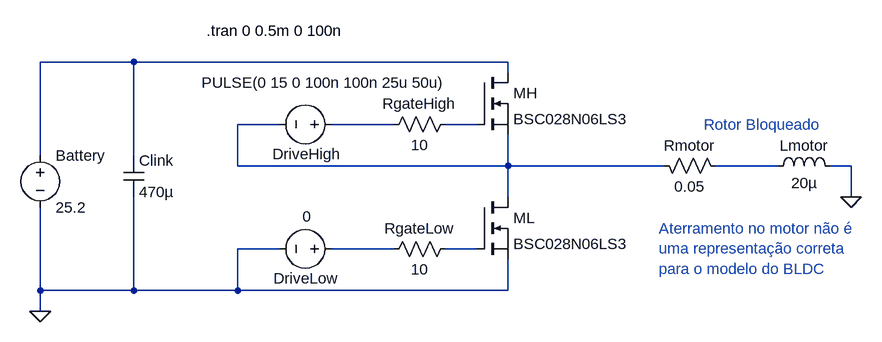
[diagram p0: schematic monofasico.asc]
monofasico.asc, the LTspice schematic file:
Version 4.1
SHEET 1 1412 992
WIRE -1024 -160 -1168 -160
WIRE -448 -160 -1024 -160
WIRE -448 -144 -448 -160
WIRE -800 -64 -864 -64
WIRE -624 -64 -720 -64
WIRE -496 -64 -544 -64
WIRE -1168 -16 -1168 -160
WIRE -1024 -16 -1024 -160
WIRE -864 0 -864 -64
WIRE -448 0 -448 -48
WIRE -448 0 -864 0
WIRE -208 0 -448 0
WIRE -32 0 -128 0
WIRE 80 0 48 0
WIRE -448 48 -448 0
WIRE 80 48 80 0
WIRE -800 128 -864 128
WIRE -624 128 -720 128
WIRE -496 128 -544 128
WIRE -1168 192 -1168 64
WIRE -1024 192 -1024 48
WIRE -1024 192 -1168 192
WIRE -864 192 -864 128
WIRE -864 192 -1024 192
WIRE -448 192 -448 144
WIRE -448 192 -864 192
WIRE -1168 224 -1168 192
FLAG -1168 224 0
FLAG 80 48 0
SYMBOL nmos -496 -144 R0
SYMATTR InstName MH
SYMATTR Value BSC028N06LS3
SYMBOL nmos -496 48 R0
SYMATTR InstName ML
SYMATTR Value BSC028N06LS3
SYMBOL voltage -1168 -32 R0
WINDOW 123 0 0 Left 0
WINDOW 39 0 0 Left 0
SYMATTR InstName Battery
SYMATTR Value 25.2
SYMBOL voltage -704 128 R90
WINDOW 123 0 0 Left 0
WINDOW 39 0 0 Left 0
WINDOW 0 45 4 VRight 2
WINDOW 3 -50 47 VRight 2
SYMATTR InstName DriveLow
SYMATTR Value 0
SYMBOL voltage -704 -64 R90
WINDOW 123 0 0 Left 0
WINDOW 39 0 0 Left 0
WINDOW 0 46 1 VRight 2
WINDOW 3 -64 -162 VRight 2
SYMATTR InstName DriveHigh
SYMATTR Value PULSE(0 15 0 100n 100n 25u 50u)
SYMBOL res -528 -80 R90
WINDOW 0 0 56 VBottom 2
WINDOW 3 32 56 VTop 2
SYMATTR InstName RgateHigh
SYMATTR Value 10
SYMBOL res -528 112 R90
WINDOW 0 0 56 VBottom 2
WINDOW 3 32 56 VTop 2
SYMATTR InstName RgateLow
SYMATTR Value 10
SYMBOL res -112 16 M270
WINDOW 0 32 56 VTop 2
WINDOW 3 0 56 VBottom 2
SYMATTR InstName Rmotor
SYMATTR Value 0.05
SYMBOL ind 64 16 M270
WINDOW 0 32 56 VTop 2
WINDOW 3 5 56 VBottom 2
SYMATTR InstName Lmotor
SYMATTR Value 20µ
SYMBOL cap -1040 -16 R0
SYMATTR InstName Clink
SYMATTR Value 470µ
SYMATTR SpiceLine Rser=0.1
TEXT -56 -64 Center 2 ;Rotor Bloqueado
TEXT -912 -208 Left 2 !.tran 0 0.5m 0 100n
TEXT -216 96 Left 2 ;Aterramento no motor não é \numa representação correta \npara o modelo do BLDC

The netlist it stands for:
* monofasico.asc
MH N001 N004 N002 N002 BSC028N06LS3
ML N002 N007 0 0 BSC028N06LS3
V§Battery N001 0 25.2
V§DriveLow N006 0 0
V§DriveHigh N003 N002 PULSE(0 15 0 100n 100n 25u 50u)
RgateHigh N004 N003 10
RgateLow N007 N006 10
Rmotor N005 N002 0.05
Lmotor 0 N005 20µ
Clink N001 0 470µ Rser=0.1
.model NMOS NMOS
.model PMOS PMOS
.lib standard.mos
* Rotor Bloqueado
.tran 0 0.5m 0 100n
* Aterramento no motor não é
* uma representação correta
* para o modelo do BLDC
.backanno
.end